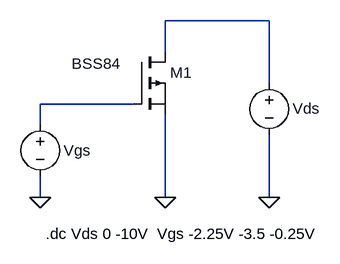
[diagram p0: schematic MOS-OUT-5.asc]
MOS-OUT-5.asc, the LTspice schematic file:
Version 4
SHEET 1 1292 680
WIRE -560 -144 -720 -144
WIRE -720 -96 -720 -144
WIRE -560 -48 -560 -144
WIRE -768 -16 -912 -16
WIRE -912 16 -912 -16
WIRE -912 128 -912 96
WIRE -720 128 -720 0
WIRE -560 128 -560 32
FLAG -560 128 0
FLAG -912 128 0
FLAG -720 128 0
SYMBOL voltage -560 -64 R0
WINDOW 123 0 0 Left 2
WINDOW 39 36 83 Left 2
WINDOW 0 36 55 Left 2
WINDOW 3 37 60 Left 2
SYMATTR InstName Vds
SYMATTR Value ""
SYMBOL voltage -912 0 R0
WINDOW 123 0 0 Left 2
WINDOW 39 40 53 Left 2
WINDOW 3 40 69 Left 2
WINDOW 0 36 56 Left 2
SYMATTR Value ""
SYMATTR InstName Vgs
SYMBOL pmos -768 -96 R0
WINDOW 3 -96 18 Left 2
SYMATTR Value BSS84
SYMATTR InstName M1
TEXT -904 184 Left 2 !.dc Vds 0 -10V  Vgs -2.25V -3.5 -0.25V

The netlist it stands for:
* MOS-OUT-5.asc
Vds N001 0
Vgs N002 0
M1 N001 N002 0 0 BSS84
.model NMOS NMOS
.model PMOS PMOS
.lib standard.mos
.dc Vds 0 -10V  Vgs -2.25V -3.5 -0.25V
.backanno
.end